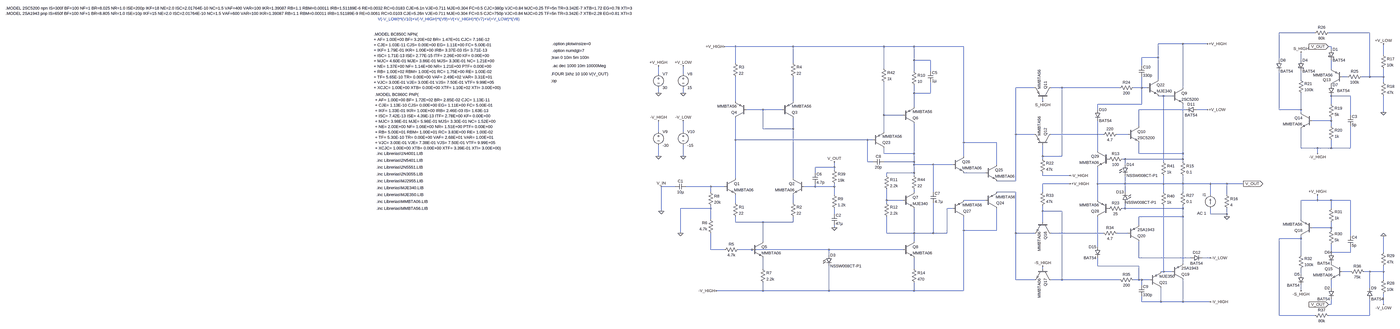
[diagram p0: schematic Rout amplificador.asc, whole sheet]
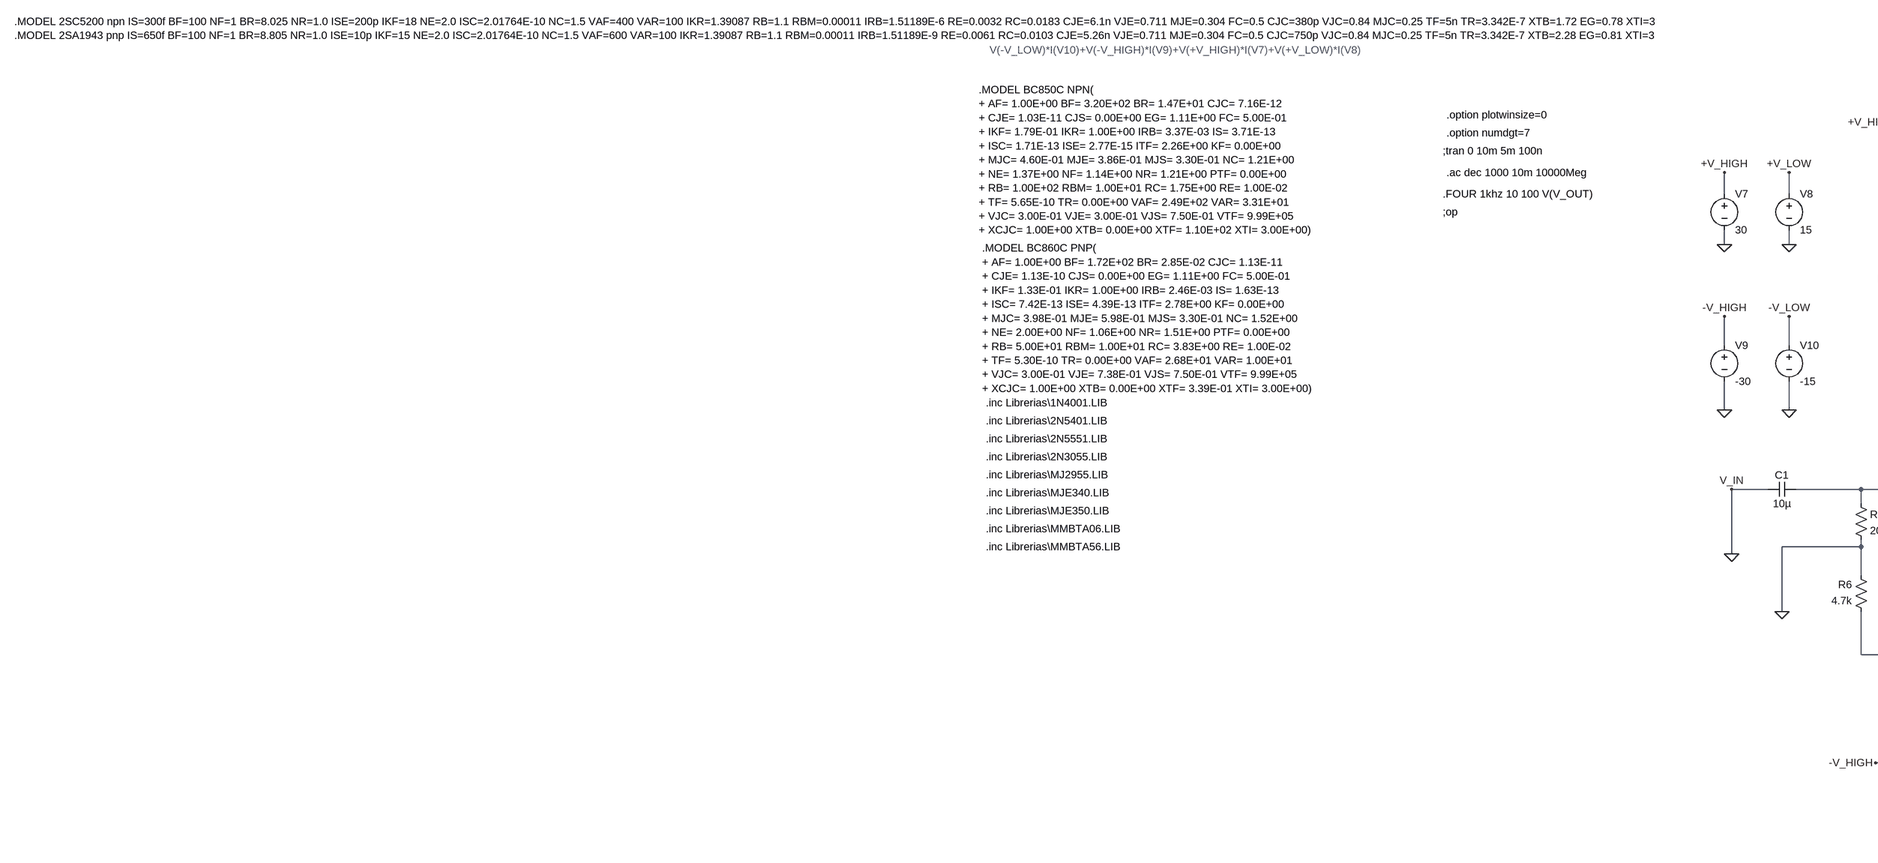
[diagram p1: schematic Rout amplificador.asc, part, row 1 of 1, column 1 of 2]
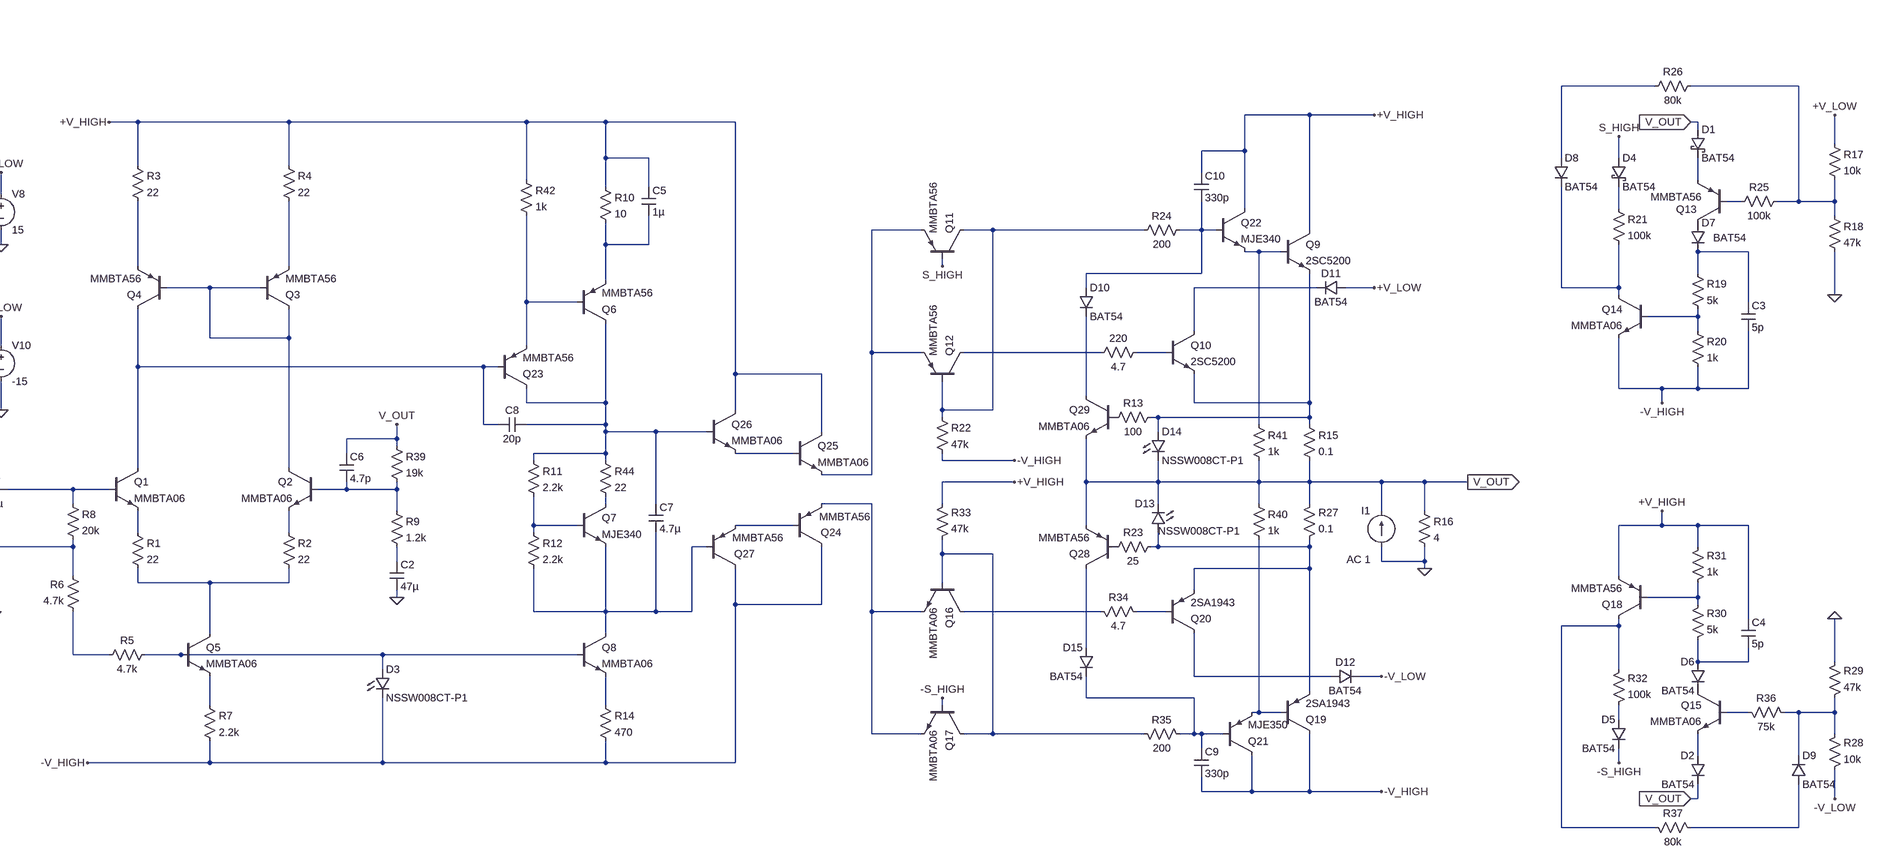
[diagram p2: schematic Rout amplificador.asc, part, row 1 of 1, column 2 of 2]
Rout amplificador.asc, the LTspice schematic file:
Version 4
SHEET 1 4516 2796
WIRE 3648 -704 3440 -704
WIRE 3968 -704 3728 -704
WIRE 2880 -640 2736 -640
WIRE 3024 -640 2880 -640
WIRE 272 -624 208 -624
WIRE 608 -624 272 -624
WIRE 1136 -624 608 -624
WIRE 1312 -624 1136 -624
WIRE 1600 -624 1312 -624
WIRE 3744 -624 3728 -624
WIRE 3744 -608 3744 -624
WIRE 4048 -576 4048 -640
WIRE 2736 -560 2736 -640
WIRE 2736 -560 2640 -560
WIRE 1312 -544 1312 -624
WIRE 1408 -544 1312 -544
WIRE 3440 -544 3440 -704
WIRE 3568 -544 3568 -592
WIRE 272 -528 272 -624
WIRE 608 -528 608 -624
WIRE 2640 -512 2640 -560
WIRE 1136 -496 1136 -624
WIRE 3744 -496 3744 -544
WIRE 1312 -480 1312 -544
WIRE 1408 -480 1408 -544
WIRE -176 -464 -176 -512
WIRE -32 -464 -32 -512
WIRE 3840 -448 3808 -448
WIRE 3968 -448 3968 -704
WIRE 3968 -448 3920 -448
WIRE 4048 -448 4048 -496
WIRE 4048 -448 3968 -448
WIRE 2736 -432 2736 -560
WIRE 3568 -432 3568 -480
WIRE 4048 -416 4048 -448
WIRE 2016 -384 1904 -384
WIRE 2176 -384 2112 -384
WIRE 2512 -384 2176 -384
WIRE 2640 -384 2640 -448
WIRE 2640 -384 2592 -384
WIRE 2672 -384 2640 -384
WIRE 2880 -384 2880 -640
WIRE -176 -352 -176 -384
WIRE -32 -352 -32 -384
WIRE 1312 -352 1312 -400
WIRE 1408 -352 1408 -416
WIRE 1408 -352 1312 -352
WIRE 2768 -336 2736 -336
WIRE 2816 -336 2768 -336
WIRE 3856 -336 3744 -336
WIRE 272 -304 272 -448
WIRE 608 -304 608 -448
WIRE 2064 -304 2064 -320
WIRE 2640 -288 2640 -384
WIRE 2640 -288 2384 -288
WIRE 3744 -288 3744 -336
WIRE 1312 -272 1312 -352
WIRE 432 -256 336 -256
WIRE 544 -256 432 -256
WIRE 2384 -256 2384 -288
WIRE 2896 -256 2624 -256
WIRE 3024 -256 2960 -256
WIRE 3440 -256 3440 -480
WIRE 3568 -256 3568 -352
WIRE 3568 -256 3440 -256
WIRE 3568 -240 3568 -256
WIRE 4048 -240 4048 -336
WIRE 1136 -224 1136 -416
WIRE 1248 -224 1136 -224
WIRE 3856 -224 3856 -336
WIRE 3744 -192 3744 -208
WIRE 3744 -192 3632 -192
WIRE 2624 -160 2624 -256
WIRE 3744 -160 3744 -192
WIRE 432 -144 432 -256
WIRE 608 -144 608 -208
WIRE 608 -144 432 -144
WIRE -176 -128 -176 -192
WIRE -32 -128 -32 -192
WIRE 1136 -128 1136 -224
WIRE 1904 -112 1904 -384
WIRE 2016 -112 1904 -112
WIRE 2416 -112 2112 -112
WIRE 2560 -112 2496 -112
WIRE 272 -80 272 -208
WIRE 1040 -80 272 -80
WIRE 1072 -80 1040 -80
WIRE 1600 -64 1600 -624
WIRE 1792 -64 1600 -64
WIRE 3568 -32 3568 -144
WIRE 3664 -32 3568 -32
WIRE 3744 -32 3744 -80
WIRE 3744 -32 3664 -32
WIRE 3856 -32 3856 -160
WIRE 3856 -32 3744 -32
WIRE 2384 -16 2384 -192
WIRE 1136 0 1136 -32
WIRE 1312 0 1312 -176
WIRE 1312 0 1136 0
WIRE 2624 0 2624 -64
WIRE 2880 0 2880 -288
WIRE 2880 0 2624 0
WIRE 3664 0 3664 -32
WIRE -176 16 -176 -48
WIRE -32 16 -32 -48
WIRE 1600 16 1600 -64
WIRE 2064 16 2064 -48
WIRE 2176 16 2176 -384
WIRE 2176 16 2064 16
WIRE 2064 32 2064 16
WIRE 2544 32 2528 32
WIRE 2880 32 2880 0
WIRE 2880 32 2544 32
WIRE 1040 48 1040 -80
WIRE 1072 48 1040 48
WIRE 1312 48 1312 0
WIRE 1312 48 1136 48
WIRE 2768 48 2768 -336
WIRE 2880 48 2880 32
WIRE 1312 64 1312 48
WIRE 1424 64 1312 64
WIRE 1536 64 1424 64
WIRE 1792 64 1792 -64
WIRE 2544 64 2544 32
WIRE 848 80 848 48
WIRE 848 80 736 80
WIRE 848 96 848 80
WIRE 736 112 736 80
WIRE 1312 112 1312 64
WIRE 1312 112 1152 112
WIRE 1728 112 1600 112
WIRE 1152 128 1152 112
WIRE 1312 128 1312 112
WIRE 2064 128 2064 112
WIRE 2224 128 2064 128
WIRE 272 144 272 -80
WIRE 608 144 608 -144
WIRE 1904 160 1904 -112
WIRE 1904 160 1792 160
WIRE 2224 176 2064 176
WIRE 2384 176 2384 80
WIRE 2544 176 2544 128
WIRE 2544 176 2384 176
WIRE 2768 176 2768 128
WIRE 2768 176 2544 176
WIRE 2880 176 2880 128
WIRE 2880 176 2768 176
WIRE 3040 176 2880 176
WIRE 3136 176 3040 176
WIRE 3232 176 3136 176
WIRE -80 192 -160 192
WIRE 128 192 -16 192
WIRE 208 192 128 192
WIRE 736 192 736 176
WIRE 736 192 672 192
WIRE 848 192 848 176
WIRE 848 192 736 192
WIRE 128 224 128 192
WIRE 1312 224 1312 208
WIRE 1424 224 1424 64
WIRE 1904 224 1792 224
WIRE 2064 224 2064 176
WIRE 2544 224 2544 176
WIRE 2768 224 2768 176
WIRE 2880 224 2880 176
WIRE 848 240 848 192
WIRE 3040 240 3040 176
WIRE 3136 240 3136 176
WIRE 1152 272 1152 208
WIRE 1248 272 1152 272
WIRE 1728 272 1600 272
WIRE 2384 272 2384 176
WIRE 3664 272 3664 240
WIRE 3664 272 3568 272
WIRE 3744 272 3664 272
WIRE 3856 272 3744 272
WIRE 272 288 272 240
WIRE 608 288 608 240
WIRE 1152 288 1152 272
WIRE 128 320 128 304
WIRE 128 320 -48 320
WIRE 1536 320 1504 320
WIRE 2544 320 2544 288
WIRE 2544 320 2528 320
WIRE 2880 320 2880 304
WIRE 2880 320 2544 320
WIRE 3744 320 3744 272
WIRE -160 336 -160 192
WIRE 2064 336 2064 304
WIRE 2176 336 2064 336
WIRE 848 352 848 320
WIRE 3040 352 3040 320
WIRE 3136 352 3136 320
WIRE 3136 352 3040 352
WIRE 2880 368 2880 320
WIRE 2880 368 2624 368
WIRE 3136 368 3136 352
WIRE 128 384 128 320
WIRE 3568 384 3568 272
WIRE 272 400 272 368
WIRE 432 400 272 400
WIRE 608 400 608 368
WIRE 608 400 432 400
WIRE 2064 400 2064 336
WIRE 2624 416 2624 368
WIRE 848 432 848 416
WIRE 3744 432 3744 400
WIRE 3744 432 3632 432
WIRE 1600 448 1600 368
WIRE 1792 448 1792 320
WIRE 1792 448 1600 448
WIRE 3744 448 3744 432
WIRE -48 464 -48 320
WIRE 1152 464 1152 368
WIRE 1312 464 1312 320
WIRE 1312 464 1152 464
WIRE 1424 464 1424 288
WIRE 1424 464 1312 464
WIRE 1504 464 1504 320
WIRE 1504 464 1424 464
WIRE 1904 464 1904 224
WIRE 2016 464 1904 464
WIRE 2416 464 2112 464
WIRE 2560 464 2496 464
WIRE 3856 480 3856 272
WIRE 3568 496 3568 480
WIRE 3568 496 3440 496
WIRE 432 512 432 400
WIRE 1312 512 1312 464
WIRE 2384 544 2384 368
WIRE 128 560 128 464
WIRE 208 560 128 560
WIRE 368 560 288 560
WIRE 816 560 368 560
WIRE 1248 560 816 560
WIRE 3744 576 3744 528
WIRE 3856 576 3856 544
WIRE 3856 576 3744 576
WIRE 4048 576 4048 480
WIRE 816 592 816 560
WIRE 3568 592 3568 496
WIRE 2624 608 2624 512
WIRE 2928 608 2624 608
WIRE 3040 608 2992 608
WIRE 2880 640 2880 368
WIRE 2384 656 2384 608
WIRE 2624 656 2384 656
WIRE 432 672 432 608
WIRE 1312 672 1312 608
WIRE 2064 672 2064 656
WIRE 2768 688 2768 304
WIRE 2768 688 2752 688
WIRE 2816 688 2768 688
WIRE 3856 688 3808 688
WIRE 3968 688 3936 688
WIRE 4048 688 4048 656
WIRE 4048 688 3968 688
WIRE 3568 704 3568 672
WIRE 1904 736 1904 464
WIRE 2016 736 1904 736
WIRE 2176 736 2176 336
WIRE 2176 736 2112 736
WIRE 2512 736 2176 736
WIRE 2624 736 2624 656
WIRE 2624 736 2592 736
WIRE 2640 736 2624 736
WIRE 2688 736 2640 736
WIRE 4048 736 4048 688
WIRE 2640 768 2640 736
WIRE 3744 784 3744 736
WIRE 3968 784 3968 688
WIRE 432 800 432 752
WIRE 432 800 160 800
WIRE 816 800 816 656
WIRE 816 800 432 800
WIRE 1312 800 1312 752
WIRE 1312 800 816 800
WIRE 1600 800 1600 448
WIRE 1600 800 1312 800
WIRE 3568 800 3568 768
WIRE 2640 864 2640 832
WIRE 2752 864 2752 784
WIRE 2752 864 2640 864
WIRE 2880 864 2880 736
WIRE 2880 864 2752 864
WIRE 3040 864 2880 864
WIRE 3744 880 3744 848
WIRE 3744 880 3728 880
WIRE 4048 880 4048 816
WIRE 3440 944 3440 496
WIRE 3648 944 3440 944
WIRE 3968 944 3968 848
WIRE 3968 944 3728 944
FLAG -48 464 0
FLAG 848 432 0
FLAG -160 336 0
FLAG 3024 -640 +V_HIGH
FLAG 3024 -256 +V_LOW
FLAG 3136 368 0
FLAG 4048 -240 0
FLAG 4048 -640 +V_LOW
FLAG 3232 176 V_OUT
IOPIN 3232 176 Out
FLAG 3728 -624 V_OUT
IOPIN 3728 -624 In
FLAG 3664 0 -V_HIGH
FLAG 2064 -304 S_HIGH
FLAG 3568 -592 S_HIGH
FLAG 2224 128 -V_HIGH
FLAG 3040 864 -V_HIGH
FLAG 3040 608 -V_LOW
FLAG 4048 480 0
FLAG 4048 880 -V_LOW
FLAG 3728 880 V_OUT
IOPIN 3728 880 In
FLAG 3664 240 +V_HIGH
FLAG 2064 656 -S_HIGH
FLAG 3568 800 -S_HIGH
FLAG 2224 176 +V_HIGH
FLAG -176 -352 0
FLAG -32 -352 0
FLAG -176 -512 +V_HIGH
FLAG -32 -512 +V_LOW
FLAG -176 16 0
FLAG -32 16 0
FLAG -176 -192 -V_HIGH
FLAG -32 -192 -V_LOW
FLAG 208 -624 +V_HIGH
FLAG 160 800 -V_HIGH
FLAG 848 48 V_OUT
FLAG -160 192 V_IN
SYMBOL npn 208 144 R0
SYMATTR InstName Q1
SYMATTR Value MMBTA06
SYMBOL npn 672 144 M0
SYMATTR InstName Q2
SYMATTR Value MMBTA06
SYMBOL pnp 544 -208 M180
SYMATTR InstName Q3
SYMATTR Value MMBTA56
SYMBOL pnp 336 -208 R180
SYMATTR InstName Q4
SYMATTR Value MMBTA56
SYMBOL res 256 -544 R0
SYMATTR InstName R3
SYMATTR Value 22
SYMBOL res 592 -544 R0
SYMATTR InstName R4
SYMATTR Value 22
SYMBOL npn 368 512 R0
SYMATTR InstName Q5
SYMATTR Value MMBTA06
SYMBOL res 304 544 R90
WINDOW 0 0 56 VBottom 2
WINDOW 3 32 56 VTop 2
SYMATTR InstName R5
SYMATTR Value 4.7k
SYMBOL res 144 480 R180
WINDOW 0 36 76 Left 2
WINDOW 3 36 40 Left 2
SYMATTR InstName R6
SYMATTR Value 4.7k
SYMBOL res 416 656 R0
SYMATTR InstName R7
SYMATTR Value 2.2k
SYMBOL res 112 208 R0
SYMATTR InstName R8
SYMATTR Value 20k
SYMBOL res 832 224 R0
SYMATTR InstName R9
SYMATTR Value 1.2k
SYMBOL cap -16 176 R90
WINDOW 0 0 32 VBottom 2
WINDOW 3 32 32 VTop 2
SYMATTR InstName C1
SYMATTR Value 10µ
SYMBOL pnp 1248 -176 M180
SYMATTR InstName Q6
SYMATTR Value MMBTA56
SYMBOL res 1296 -496 R0
SYMATTR InstName R10
SYMATTR Value 10
SYMBOL npn 1248 224 R0
SYMATTR InstName Q7
SYMATTR Value MJE340
SYMBOL res 1136 112 R0
SYMATTR InstName R11
SYMATTR Value 2.2k
SYMBOL res 1136 272 R0
SYMATTR InstName R12
SYMATTR Value 2.2k
SYMBOL npn 1248 512 R0
SYMATTR InstName Q8
SYMATTR Value MMBTA06
SYMBOL res 1296 656 R0
SYMATTR InstName R14
SYMATTR Value 470
SYMBOL cap 832 352 R0
SYMATTR InstName C2
SYMATTR Value 47µ
SYMBOL npn 2816 -384 R0
SYMATTR InstName Q9
SYMATTR Value 2SC5200
SYMBOL npn 2560 -160 R0
SYMATTR InstName Q10
SYMATTR Value 2SC5200
SYMBOL res 2864 32 R0
SYMATTR InstName R15
SYMATTR Value 0.1
SYMBOL pnp 2112 -320 M270
SYMATTR InstName Q11
SYMATTR Value MMBTA56
SYMBOL pnp 2112 -48 M270
SYMATTR InstName Q12
SYMATTR Value MMBTA56
SYMBOL res 3120 224 R0
SYMATTR InstName R16
SYMATTR Value 4
SYMBOL res 4032 -592 R0
SYMATTR InstName R17
SYMATTR Value 10k
SYMBOL res 4032 -432 R0
SYMATTR InstName R18
SYMATTR Value 47k
SYMBOL pnp 3808 -400 R180
WINDOW 0 67 30 Left 2
WINDOW 3 55 58 Left 2
SYMATTR InstName Q13
SYMATTR Value MMBTA56
SYMBOL res 3728 -304 R0
SYMATTR InstName R19
SYMATTR Value 5k
SYMBOL res 3728 -176 R0
SYMATTR InstName R20
SYMATTR Value 1k
SYMBOL npn 3632 -240 M0
SYMATTR InstName Q14
SYMATTR Value MMBTA06
SYMBOL res 3552 -448 R0
SYMATTR InstName R21
SYMATTR Value 100k
SYMBOL res 2048 16 R0
SYMATTR InstName R22
SYMATTR Value 47k
SYMBOL cap 3840 -224 R0
SYMATTR InstName C3
SYMATTR Value 5p
SYMBOL schottky 3728 -608 R0
SYMATTR InstName D1
SYMATTR Value BAT54
SYMATTR Description Diode
SYMATTR Type diode
SYMBOL res 2512 -128 R90
WINDOW 0 0 56 VBottom 2
WINDOW 3 32 56 VTop 2
SYMATTR InstName 220
SYMATTR Value 4.7
SYMBOL res 2608 -400 R90
WINDOW 0 0 56 VBottom 2
WINDOW 3 32 56 VTop 2
SYMATTR InstName R24
SYMATTR Value 200
SYMBOL res 3936 -464 R90
WINDOW 0 0 56 VBottom 2
WINDOW 3 32 56 VTop 2
SYMATTR InstName R25
SYMATTR Value 100k
SYMBOL res 3744 -720 R90
WINDOW 0 0 56 VBottom 2
WINDOW 3 32 56 VTop 2
SYMATTR InstName R26
SYMATTR Value 80k
SYMBOL res 2864 320 M180
WINDOW 0 36 76 Left 2
WINDOW 3 36 40 Left 2
SYMATTR InstName R27
SYMATTR Value 0.1
SYMBOL res 4032 832 M180
WINDOW 0 36 76 Left 2
WINDOW 3 36 40 Left 2
SYMATTR InstName R28
SYMATTR Value 10k
SYMBOL res 4032 672 M180
WINDOW 0 36 76 Left 2
WINDOW 3 36 40 Left 2
SYMATTR InstName R29
SYMATTR Value 47k
SYMBOL res 3728 544 M180
WINDOW 0 36 76 Left 2
WINDOW 3 36 40 Left 2
SYMATTR InstName R30
SYMATTR Value 5k
SYMBOL res 3728 416 M180
WINDOW 0 36 76 Left 2
WINDOW 3 36 40 Left 2
SYMATTR InstName R31
SYMATTR Value 1k
SYMBOL res 3552 688 M180
WINDOW 0 36 76 Left 2
WINDOW 3 36 40 Left 2
SYMATTR InstName R32
SYMATTR Value 100k
SYMBOL res 2048 320 M180
WINDOW 0 36 76 Left 2
WINDOW 3 36 40 Left 2
SYMATTR InstName R33
SYMATTR Value 47k
SYMBOL cap 3840 544 M180
WINDOW 0 24 56 Left 2
WINDOW 3 24 8 Left 2
SYMATTR InstName C4
SYMATTR Value 5p
SYMBOL diode 3760 784 M0
SYMATTR InstName D2
SYMATTR Value BAT54
SYMBOL res 2512 480 M270
WINDOW 0 32 56 VTop 2
WINDOW 3 0 56 VBottom 2
SYMATTR InstName R34
SYMATTR Value 4.7
SYMBOL res 2608 752 M270
WINDOW 0 32 56 VTop 2
WINDOW 3 0 56 VBottom 2
SYMATTR InstName R35
SYMATTR Value 200
SYMBOL res 3952 704 M270
WINDOW 0 32 56 VTop 2
WINDOW 3 0 56 VBottom 2
SYMATTR InstName R36
SYMATTR Value 75k
SYMBOL res 3744 960 M270
WINDOW 0 32 56 VTop 2
WINDOW 3 0 56 VBottom 2
SYMATTR InstName R37
SYMATTR Value 80k
SYMBOL npn 3808 640 M0
SYMATTR InstName Q15
SYMATTR Value MMBTA06
SYMBOL npn 2112 400 R90
SYMATTR InstName Q16
SYMATTR Value MMBTA06
SYMBOL npn 2112 672 R90
SYMATTR InstName Q17
SYMATTR Value MMBTA06
SYMBOL pnp 3632 480 R180
SYMATTR InstName Q18
SYMATTR Value MMBTA56
SYMBOL pnp 2816 736 M180
SYMATTR InstName Q19
SYMATTR Value 2SA1943
SYMBOL pnp 2560 512 M180
SYMATTR InstName Q20
SYMATTR Value 2SA1943
SYMBOL voltage -176 -480 R0
WINDOW 123 0 0 Left 0
WINDOW 39 0 0 Left 0
SYMATTR InstName V7
SYMATTR Value 30
SYMBOL voltage -32 -480 R0
WINDOW 123 0 0 Left 0
WINDOW 39 0 0 Left 0
SYMATTR InstName V8
SYMATTR Value 15
SYMBOL voltage -176 -144 R0
WINDOW 123 0 0 Left 0
WINDOW 39 0 0 Left 0
SYMATTR InstName V9
SYMATTR Value -30
SYMBOL voltage -32 -144 R0
WINDOW 123 0 0 Left 0
WINDOW 39 0 0 Left 0
SYMATTR InstName V10
SYMATTR Value -15
SYMBOL res 832 80 R0
SYMATTR InstName R39
SYMATTR Value 19k
SYMBOL LED 800 592 R0
SYMATTR InstName D3
SYMATTR Value NSSW008CT-P1
SYMBOL cap 1392 -480 R0
SYMATTR InstName C5
SYMATTR Value 1µ
SYMBOL pnp 2688 784 M180
SYMATTR InstName Q21
SYMATTR Value MJE350
SYMBOL res 2752 208 R0
SYMATTR InstName R40
SYMATTR Value 1k
SYMBOL npn 2672 -432 R0
SYMATTR InstName Q22
SYMATTR Value MJE340
SYMBOL res 2752 32 R0
SYMATTR InstName R41
SYMATTR Value 1k
SYMBOL cap 720 112 R0
SYMATTR InstName C6
SYMATTR Value 4.7p
SYMBOL pnp 1072 -32 M180
SYMATTR InstName Q23
SYMATTR Value MMBTA56
SYMBOL res 1120 -512 R0
SYMATTR InstName R42
SYMATTR Value 1k
SYMBOL cap 1408 224 R0
SYMATTR InstName C7
SYMATTR Value 4.7µ
SYMBOL schottky 3552 -544 R0
SYMATTR InstName D4
SYMATTR Value BAT54
SYMATTR Description Diode
SYMATTR Type diode
SYMBOL diode 3584 704 M0
SYMATTR InstName D5
SYMATTR Value BAT54
SYMBOL diode 3760 576 M0
SYMATTR InstName D6
SYMATTR Value BAT54
SYMBOL diode 3728 -400 R0
WINDOW 3 50 33 Left 2
SYMATTR Value BAT54
SYMATTR InstName D7
SYMBOL diode 3424 -544 R0
SYMATTR InstName D8
SYMATTR Value BAT54
SYMBOL diode 3952 848 M180
WINDOW 0 24 64 Left 2
WINDOW 3 24 0 Left 2
SYMATTR InstName D9
SYMATTR Value BAT54
SYMBOL pnp 1728 320 M180
WINDOW 0 62 32 Left 2
WINDOW 3 59 67 Left 2
SYMATTR InstName Q24
SYMATTR Value MMBTA56
SYMBOL npn 1728 64 R0
SYMATTR InstName Q25
SYMATTR Value MMBTA06
SYMBOL npn 1536 16 R0
SYMATTR InstName Q26
SYMATTR Value MMBTA06
SYMBOL pnp 1536 368 M180
WINDOW 0 62 32 Left 2
WINDOW 3 58 68 Left 2
SYMATTR InstName Q27
SYMATTR Value MMBTA56
SYMBOL res 1296 112 R0
SYMATTR InstName R44
SYMATTR Value 22
SYMBOL pnp 2448 368 R180
SYMATTR InstName Q28
SYMATTR Value MMBTA56
SYMBOL npn 2448 -16 M0
SYMATTR InstName Q29
SYMATTR Value MMBTA06
SYMBOL cap 2624 768 R0
SYMATTR InstName C9
SYMATTR Value 330p
SYMBOL cap 2624 -512 R0
SYMATTR InstName C10
SYMATTR Value 330p
SYMBOL diode 2960 -272 R90
WINDOW 0 0 32 VBottom 2
WINDOW 3 32 32 VTop 2
SYMATTR InstName D11
SYMATTR Value BAT54
SYMBOL diode 2928 592 M90
WINDOW 0 0 32 VBottom 2
WINDOW 3 32 32 VTop 2
SYMATTR InstName D12
SYMATTR Value BAT54
SYMBOL LED 2528 64 R0
SYMATTR InstName D14
SYMATTR Value NSSW008CT-P1
SYMBOL res 2544 16 R90
WINDOW 0 0 56 VBottom 2
WINDOW 3 32 56 VTop 2
SYMATTR InstName R13
SYMATTR Value 100
SYMBOL LED 2560 288 R180
WINDOW 0 24 64 Left 2
WINDOW 3 -165 3 Left 2
SYMATTR InstName D13
SYMATTR Value NSSW008CT-P1
SYMBOL diode 2368 -256 R0
SYMATTR InstName D10
SYMATTR Value BAT54
SYMBOL cap 1136 32 R90
WINDOW 0 0 32 VBottom 2
WINDOW 3 32 32 VTop 2
SYMATTR InstName C8
SYMATTR Value 20p
SYMBOL diode 2400 544 M0
SYMATTR InstName D15
SYMATTR Value BAT54
SYMBOL res 2544 304 R90
WINDOW 0 0 56 VBottom 2
WINDOW 3 32 56 VTop 2
SYMATTR InstName R23
SYMATTR Value 25
SYMBOL res 256 272 R0
SYMATTR InstName R1
SYMATTR Value 22
SYMBOL res 592 272 R0
SYMATTR InstName R2
SYMATTR Value 22
SYMBOL current 3040 320 R180
WINDOW 0 24 80 Left 2
WINDOW 3 24 0 Left 2
WINDOW 123 24 -28 Left 2
WINDOW 39 0 0 Left 0
SYMATTR InstName I1
SYMATTR Value ""
SYMATTR Value2 AC 1
TEXT -1512 -560 Left 2 !;tran 0 10m 5m 100n
TEXT -1512 -464 Left 2 !.FOUR 1khz 10 100 V(V_OUT)
TEXT -2528 160 Left 2 !.inc Librerias\\MJ2955.LIB
TEXT -2528 120 Left 2 !.inc Librerias\\2N3055.LIB
TEXT -2528 80 Left 2 !.inc Librerias\\2N5551.LIB
TEXT -2528 40 Left 2 !.inc Librerias\\2N5401.LIB
TEXT -2528 0 Left 2 !.inc Librerias\\1N4001.LIB
TEXT -2544 -696 Left 2 !.MODEL BC850C NPN(\n+ AF= 1.00E+00 BF= 3.20E+02 BR= 1.47E+01 CJC= 7.16E-12\n+ CJE= 1.03E-11 CJS= 0.00E+00 EG= 1.11E+00 FC= 5.00E-01\n+ IKF= 1.79E-01 IKR= 1.00E+00 IRB= 3.37E-03 IS= 3.71E-13\n+ ISC= 1.71E-13 ISE= 2.77E-15 ITF= 2.26E+00 KF= 0.00E+00\n+ MJC= 4.60E-01 MJE= 3.86E-01 MJS= 3.30E-01 NC= 1.21E+00\n+ NE= 1.37E+00 NF= 1.14E+00 NR= 1.21E+00 PTF= 0.00E+00\n+ RB= 1.00E+02 RBM= 1.00E+01 RC= 1.75E+00 RE= 1.00E-02\n+ TF= 5.65E-10 TR= 0.00E+00 VAF= 2.49E+02 VAR= 3.31E+01\n+ VJC= 3.00E-01 VJE= 3.00E-01 VJS= 7.50E-01 VTF= 9.99E+05\n+ XCJC= 1.00E+00 XTB= 0.00E+00 XTF= 1.10E+02 XTI= 3.00E+00)
TEXT -2536 -344 Left 2 !.MODEL BC860C PNP(\n+ AF= 1.00E+00 BF= 1.72E+02 BR= 2.85E-02 CJC= 1.13E-11\n+ CJE= 1.13E-10 CJS= 0.00E+00 EG= 1.11E+00 FC= 5.00E-01\n+ IKF= 1.33E-01 IKR= 1.00E+00 IRB= 2.46E-03 IS= 1.63E-13\n+ ISC= 7.42E-13 ISE= 4.39E-13 ITF= 2.78E+00 KF= 0.00E+00\n+ MJC= 3.98E-01 MJE= 5.98E-01 MJS= 3.30E-01 NC= 1.52E+00\n+ NE= 2.00E+00 NF= 1.06E+00 NR= 1.51E+00 PTF= 0.00E+00\n+ RB= 5.00E+01 RBM= 1.00E+01 RC= 3.83E+00 RE= 1.00E-02\n+ TF= 5.30E-10 TR= 0.00E+00 VAF= 2.68E+01 VAR= 1.00E+01\n+ VJC= 3.00E-01 VJE= 7.38E-01 VJS= 7.50E-01 VTF= 9.99E+05\n+ XCJC= 1.00E+00 XTB= 0.00E+00 XTF= 3.39E-01 XTI= 3.00E+00)
TEXT -1504 -512 Left 2 !.ac dec 1000 10m 10000Meg
TEXT -1512 -424 Left 2 !;op
TEXT -1504 -600 Left 2 !.option numdgt=7
TEXT -2528 200 Left 2 !.inc Librerias\\MJE340.LIB
TEXT -2528 240 Left 2 !.inc Librerias\\MJE350.LIB
TEXT -2528 280 Left 2 !.inc Librerias\\MMBTA06.LIB
TEXT -2528 320 Left 2 !.inc Librerias\\MMBTA56.LIB
TEXT -1504 -640 Left 2 !.option plotwinsize=0
TEXT -4688 -848 Left 2 !.MODEL 2SC5200 npn IS=300f BF=100 NF=1 BR=8.025 NR=1.0 ISE=200p IKF=18 NE=2.0 ISC=2.01764E-10 NC=1.5 VAF=400 VAR=100 IKR=1.39087 RB=1.1 RBM=0.00011 IRB=1.51189E-6 RE=0.0032 RC=0.0183 CJE=6.1n VJE=0.711 MJE=0.304 FC=0.5 CJC=380p VJC=0.84 MJC=0.25 TF=5n TR=3.342E-7 XTB=1.72 EG=0.78 XTI=3\n.MODEL 2SA1943 pnp IS=650f BF=100 NF=1 BR=8.805 NR=1.0 ISE=10p IKF=15 NE=2.0 ISC=2.01764E-10 NC=1.5 VAF=600 VAR=100 IKR=1.39087 RB=1.1 RBM=0.00011 IRB=1.51189E-9 RE=0.0061 RC=0.0103 CJE=5.26n VJE=0.711 MJE=0.304 FC=0.5 CJC=750p VJC=0.84 MJC=0.25 TF=5n TR=3.342E-7 XTB=2.28 EG=0.81 XTI=3
TEXT -2520 -784 Left 2 ;V(-V_LOW)*I(V10)+V(-V_HIGH)*I(V9)+V(+V_HIGH)*I(V7)+V(+V_LOW)*I(V8)

The netlist it stands for:
* Rout amplificador.asc
Q1 N021 N026 N032 0 MMBTA06
Q2 N014 N027 N033 0 MMBTA06
Q3 N014 N014 N013 0 MMBTA56
Q4 N021 N014 N012 0 MMBTA56
R3 +V_HIGH N012 22
R4 +V_HIGH N013 22
Q5 N038 N045 N049 0 MMBTA06
R5 N045 N044 4.7k
R6 N044 0 4.7k
R7 N049 -V_HIGH 2.2k
R8 N026 0 20k
R9 N027 N037 1.2k
C1 N026 0 10µ
Q6 N023 N017 N009 0 MMBTA56
R10 +V_HIGH N009 10
Q7 N028 N030 N034 0 MJE340
R11 N023 N030 2.2k
R12 N030 N034 2.2k
Q8 N034 N045 N050 0 MMBTA06
R14 N050 -V_HIGH 470
C2 N037 0 47µ
Q9 +V_HIGH N010 N024 0 2SC5200
Q10 N015 N020 N024 0 2SC5200
R15 N024 V_OUT 0.1
Q11 N007 S_HIGH N006 0 MMBTA56
Q12 N019 N007 N006 0 MMBTA56
R16 V_OUT 0 4
R17 +V_LOW N002 10k
R18 N002 0 47k
Q13 P001 N004 N003 0 MMBTA56
R19 N011 N018 5k
R20 N018 -V_HIGH 1k
Q14 N016 N018 -V_HIGH 0 MMBTA06
R21 N005 N016 100k
R22 N007 -V_HIGH 47k
C3 N011 -V_HIGH 5p
D1 V_OUT N003 BAT54
R§220 N020 N019 4.7
R24 N008 N007 200
R25 N002 N004 100k
R26 N002 N001 80k
R27 N035 V_OUT 0.1
R28 -V_LOW N053 10k
R29 N053 0 47k
R30 N046 N039 5k
R31 N039 +V_HIGH 1k
R32 N054 N042 100k
R33 N036 +V_HIGH 47k
C4 N046 +V_HIGH 5p
D2 N055 V_OUT BAT54
R34 N041 N040 4.7
R35 N048 N036 200
R36 N053 N052 75k
R37 N056 N042 80k
Q15 P002 N052 N055 0 MMBTA06
Q16 N040 N036 N029 0 MMBTA06
Q17 N036 -S_HIGH N029 0 MMBTA06
Q18 N042 N039 +V_HIGH 0 MMBTA56
Q19 -V_HIGH N051 N035 0 2SA1943
Q20 N047 N041 N035 0 2SA1943
V7 +V_HIGH 0 30
V8 +V_LOW 0 15
V9 -V_HIGH 0 -30
V10 -V_LOW 0 -15
R39 V_OUT N027 19k
D3 N045 -V_HIGH NSSW008CT-P1
C5 +V_HIGH N009 1µ
Q21 -V_HIGH N048 N051 0 MJE350
R40 V_OUT N051 1k
Q22 +V_HIGH N008 N010 0 MJE340
R41 N010 V_OUT 1k
C6 V_OUT N027 4.7p
Q23 N023 N021 N017 0 MMBTA56
R42 +V_HIGH N017 1k
C7 N023 N034 4.7µ
D4 S_HIGH N005 BAT54
D5 N054 -S_HIGH BAT54
D6 N046 P002 BAT54
D7 P001 N011 BAT54
D8 N001 N016 BAT54
D9 N056 N053 BAT54
Q24 -V_HIGH N031 N029 0 MMBTA56
Q25 +V_HIGH N025 N006 0 MMBTA06
Q26 +V_HIGH N023 N025 0 MMBTA06
Q27 -V_HIGH N034 N031 0 MMBTA56
R44 N023 N028 22
Q28 N043 P003 V_OUT 0 MMBTA56
Q29 N022 P004 V_OUT 0 MMBTA06
C9 N048 -V_HIGH 330p
C10 +V_HIGH N008 330p
D11 +V_LOW N015 BAT54
D12 N047 -V_LOW BAT54
D14 N024 V_OUT NSSW008CT-P1
R13 N024 P004 100
D13 N035 V_OUT NSSW008CT-P1
D10 N008 N022 BAT54
C8 N023 N021 20p
D15 N043 N048 BAT54
R23 N035 P003 25
R1 N032 N038 22
R2 N033 N038 22
I1 0 V_OUT AC 1
.model D D
.lib standard.dio
.model NPN NPN
.model PNP PNP
.lib standard.bjt
;tran 0 10m 5m 100n
.FOUR 1khz 10 100 V(V_OUT)
.inc Librerias\MJ2955.LIB
.inc Librerias\2N3055.LIB
.inc Librerias\2N5551.LIB
.inc Librerias\2N5401.LIB
.inc Librerias\1N4001.LIB
.MODEL BC850C NPN(
+ AF= 1.00E+00 BF= 3.20E+02 BR= 1.47E+01 CJC= 7.16E-12
+ CJE= 1.03E-11 CJS= 0.00E+00 EG= 1.11E+00 FC= 5.00E-01
+ IKF= 1.79E-01 IKR= 1.00E+00 IRB= 3.37E-03 IS= 3.71E-13
+ ISC= 1.71E-13 ISE= 2.77E-15 ITF= 2.26E+00 KF= 0.00E+00
+ MJC= 4.60E-01 MJE= 3.86E-01 MJS= 3.30E-01 NC= 1.21E+00
+ NE= 1.37E+00 NF= 1.14E+00 NR= 1.21E+00 PTF= 0.00E+00
+ RB= 1.00E+02 RBM= 1.00E+01 RC= 1.75E+00 RE= 1.00E-02
+ TF= 5.65E-10 TR= 0.00E+00 VAF= 2.49E+02 VAR= 3.31E+01
+ VJC= 3.00E-01 VJE= 3.00E-01 VJS= 7.50E-01 VTF= 9.99E+05
+ XCJC= 1.00E+00 XTB= 0.00E+00 XTF= 1.10E+02 XTI= 3.00E+00)
.MODEL BC860C PNP(
+ AF= 1.00E+00 BF= 1.72E+02 BR= 2.85E-02 CJC= 1.13E-11
+ CJE= 1.13E-10 CJS= 0.00E+00 EG= 1.11E+00 FC= 5.00E-01
+ IKF= 1.33E-01 IKR= 1.00E+00 IRB= 2.46E-03 IS= 1.63E-13
+ ISC= 7.42E-13 ISE= 4.39E-13 ITF= 2.78E+00 KF= 0.00E+00
+ MJC= 3.98E-01 MJE= 5.98E-01 MJS= 3.30E-01 NC= 1.52E+00
+ NE= 2.00E+00 NF= 1.06E+00 NR= 1.51E+00 PTF= 0.00E+00
+ RB= 5.00E+01 RBM= 1.00E+01 RC= 3.83E+00 RE= 1.00E-02
+ TF= 5.30E-10 TR= 0.00E+00 VAF= 2.68E+01 VAR= 1.00E+01
+ VJC= 3.00E-01 VJE= 7.38E-01 VJS= 7.50E-01 VTF= 9.99E+05
+ XCJC= 1.00E+00 XTB= 0.00E+00 XTF= 3.39E-01 XTI= 3.00E+00)
.ac dec 1000 10m 10000Meg
;op
.option numdgt=7
.inc Librerias\MJE340.LIB
.inc Librerias\MJE350.LIB
.inc Librerias\MMBTA06.LIB
.inc Librerias\MMBTA56.LIB
.option plotwinsize=0
.MODEL 2SC5200 npn IS=300f BF=100 NF=1 BR=8.025 NR=1.0 ISE=200p IKF=18 NE=2.0 ISC=2.01764E-10 NC=1.5 VAF=400 VAR=100 IKR=1.39087 RB=1.1 RBM=0.00011 IRB=1.51189E-6 RE=0.0032 RC=0.0183 CJE=6.1n VJE=0.711 MJE=0.304 FC=0.5 CJC=380p VJC=0.84 MJC=0.25 TF=5n TR=3.342E-7 XTB=1.72 EG=0.78 XTI=3
.MODEL 2SA1943 pnp IS=650f BF=100 NF=1 BR=8.805 NR=1.0 ISE=10p IKF=15 NE=2.0 ISC=2.01764E-10 NC=1.5 VAF=600 VAR=100 IKR=1.39087 RB=1.1 RBM=0.00011 IRB=1.51189E-9 RE=0.0061 RC=0.0103 CJE=5.26n VJE=0.711 MJE=0.304 FC=0.5 CJC=750p VJC=0.84 MJC=0.25 TF=5n TR=3.342E-7 XTB=2.28 EG=0.81 XTI=3
* V(-V_LOW)*I(V10)+V(-V_HIGH)*I(V9)+V(+V_HIGH)*I(V7)+V(+V_LOW)*I(V8)
.backanno
.end